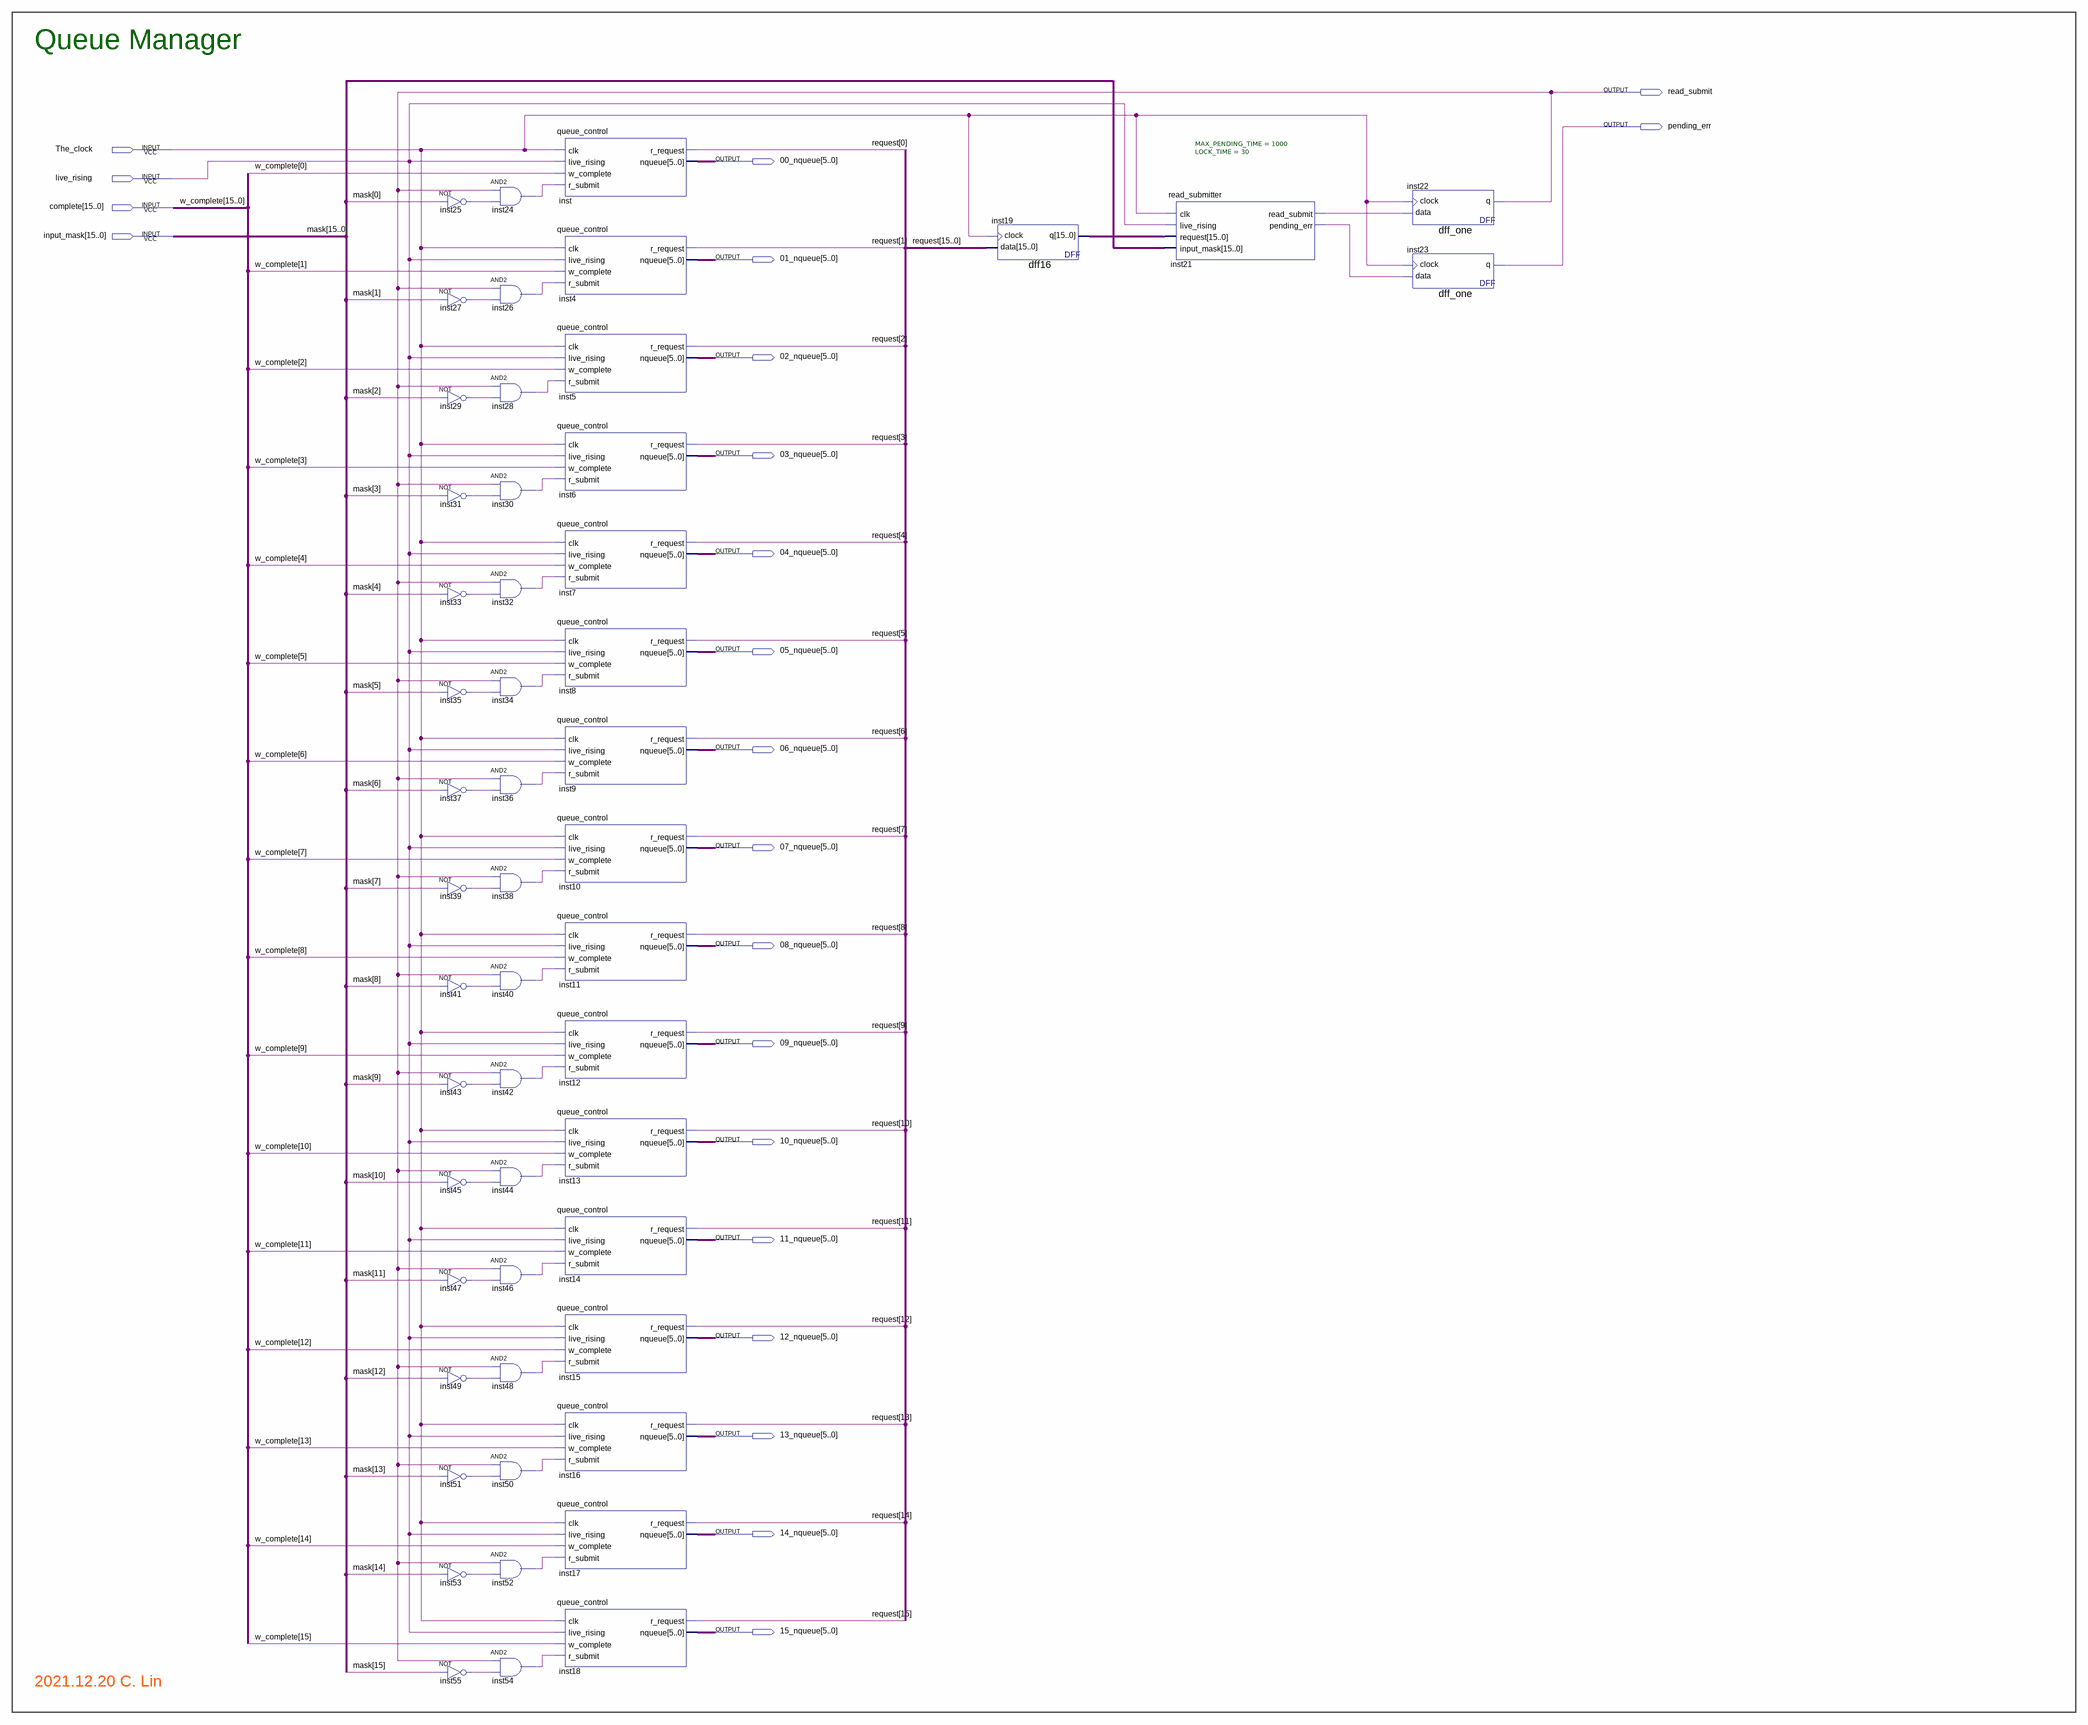
[diagram p0: schematic sheet]
// Quartus schematic queue_manager.bdf as structural Verilog: 52 symbols, 22 pins
module queue_manager (
  input  The_clock,
  input  live_rising,
  input  [15:0] complete,
  input  [15:0] input_mask,
  output read_submit,
  output pending_err,
  output [5:0] \00_nqueue ,
  output [5:0] \01_nqueue ,
  output [5:0] \02_nqueue ,
  output [5:0] \03_nqueue ,
  output [5:0] \04_nqueue ,
  output [5:0] \05_nqueue ,
  output [5:0] \06_nqueue ,
  output [5:0] \07_nqueue ,
  output [5:0] \08_nqueue ,
  output [5:0] \09_nqueue ,
  output [5:0] \10_nqueue ,
  output [5:0] \11_nqueue ,
  output [5:0] \12_nqueue ,
  output [5:0] \13_nqueue ,
  output [5:0] \14_nqueue ,
  output [5:0] \15_nqueue 
);

  wire inst21_pending_err, inst21_read_submit, inst24_out, inst25_out, inst26_out, inst27_out, inst28_out,
       inst29_out, inst30_out, inst31_out, inst32_out, inst33_out, inst34_out, inst35_out, inst36_out,
       inst37_out, inst38_out, inst39_out, inst40_out, inst41_out, inst42_out, inst43_out, inst44_out,
       inst45_out, inst46_out, inst47_out, inst48_out, inst49_out, inst50_out, inst51_out, inst52_out,
       inst53_out, inst54_out, inst55_out;
  wire [15:0] inst19_q, request;

  not inst25 (inst25_out, input_mask[0]);
  not inst27 (inst27_out, input_mask[1]);
  not inst29 (inst29_out, input_mask[2]);
  not inst31 (inst31_out, input_mask[3]);
  not inst33 (inst33_out, input_mask[4]);
  not inst35 (inst35_out, input_mask[5]);
  not inst37 (inst37_out, input_mask[6]);
  not inst39 (inst39_out, input_mask[7]);
  not inst41 (inst41_out, input_mask[8]);
  not inst43 (inst43_out, input_mask[9]);
  not inst45 (inst45_out, input_mask[10]);
  not inst47 (inst47_out, input_mask[11]);
  not inst49 (inst49_out, input_mask[12]);
  not inst51 (inst51_out, input_mask[13]);
  not inst53 (inst53_out, input_mask[14]);
  not inst55 (inst55_out, input_mask[15]);
  and inst24 (inst24_out, read_submit, inst25_out);
  and inst26 (inst26_out, read_submit, inst27_out);
  and inst28 (inst28_out, read_submit, inst29_out);
  and inst30 (inst30_out, read_submit, inst31_out);
  and inst32 (inst32_out, read_submit, inst33_out);
  and inst34 (inst34_out, read_submit, inst35_out);
  and inst36 (inst36_out, read_submit, inst37_out);
  and inst38 (inst38_out, read_submit, inst39_out);
  and inst40 (inst40_out, read_submit, inst41_out);
  and inst42 (inst42_out, read_submit, inst43_out);
  and inst44 (inst44_out, read_submit, inst45_out);
  and inst46 (inst46_out, read_submit, inst47_out);
  and inst48 (inst48_out, read_submit, inst49_out);
  and inst50 (inst50_out, read_submit, inst51_out);
  and inst52 (inst52_out, read_submit, inst53_out);
  and inst54 (inst54_out, read_submit, inst55_out);
  queue_control inst (
    .clk(The_clock), .live_rising(live_rising), .w_complete(complete[0]), .r_submit(inst24_out),
    .r_request(request[0]), .nqueue(\00_nqueue ));
  queue_control inst4 (
    .clk(The_clock), .live_rising(live_rising), .w_complete(complete[1]), .r_submit(inst26_out),
    .r_request(request[1]), .nqueue(\01_nqueue ));
  queue_control inst5 (
    .clk(The_clock), .live_rising(live_rising), .w_complete(complete[2]), .r_submit(inst28_out),
    .r_request(request[2]), .nqueue(\02_nqueue ));
  queue_control inst6 (
    .clk(The_clock), .live_rising(live_rising), .w_complete(complete[3]), .r_submit(inst30_out),
    .r_request(request[3]), .nqueue(\03_nqueue ));
  queue_control inst7 (
    .clk(The_clock), .live_rising(live_rising), .w_complete(complete[4]), .r_submit(inst32_out),
    .r_request(request[4]), .nqueue(\04_nqueue ));
  queue_control inst8 (
    .clk(The_clock), .live_rising(live_rising), .w_complete(complete[5]), .r_submit(inst34_out),
    .r_request(request[5]), .nqueue(\05_nqueue ));
  queue_control inst9 (
    .clk(The_clock), .live_rising(live_rising), .w_complete(complete[6]), .r_submit(inst36_out),
    .r_request(request[6]), .nqueue(\06_nqueue ));
  queue_control inst10 (
    .clk(The_clock), .live_rising(live_rising), .w_complete(complete[7]), .r_submit(inst38_out),
    .r_request(request[7]), .nqueue(\07_nqueue ));
  queue_control inst11 (
    .clk(The_clock), .live_rising(live_rising), .w_complete(complete[8]), .r_submit(inst40_out),
    .r_request(request[8]), .nqueue(\08_nqueue ));
  queue_control inst12 (
    .clk(The_clock), .live_rising(live_rising), .w_complete(complete[9]), .r_submit(inst42_out),
    .r_request(request[9]), .nqueue(\09_nqueue ));
  queue_control inst13 (
    .clk(The_clock), .live_rising(live_rising), .w_complete(complete[10]), .r_submit(inst44_out),
    .r_request(request[10]), .nqueue(\10_nqueue ));
  queue_control inst14 (
    .clk(The_clock), .live_rising(live_rising), .w_complete(complete[11]), .r_submit(inst46_out),
    .r_request(request[11]), .nqueue(\11_nqueue ));
  queue_control inst15 (
    .clk(The_clock), .live_rising(live_rising), .w_complete(complete[12]), .r_submit(inst48_out),
    .r_request(request[12]), .nqueue(\12_nqueue ));
  queue_control inst16 (
    .clk(The_clock), .live_rising(live_rising), .w_complete(complete[13]), .r_submit(inst50_out),
    .r_request(request[13]), .nqueue(\13_nqueue ));
  queue_control inst17 (
    .clk(The_clock), .live_rising(live_rising), .w_complete(complete[14]), .r_submit(inst52_out),
    .r_request(request[14]), .nqueue(\14_nqueue ));
  queue_control inst18 (
    .clk(The_clock), .live_rising(live_rising), .w_complete(complete[15]), .r_submit(inst54_out),
    .r_request(request[15]), .nqueue(\15_nqueue ));
  dff16 inst19 (.data(request), .clock(The_clock), .q(inst19_q));
  read_submitter #(.MAX_PENDING_TIME(1000), .LOCK_TIME(30)) inst21 (
    .clk(The_clock), .live_rising(live_rising), .request(inst19_q), .input_mask(input_mask),
    .read_submit(inst21_read_submit), .pending_err(inst21_pending_err));
  dff_one inst22 (.data(inst21_read_submit), .clock(The_clock), .q(read_submit));
  dff_one inst23 (.data(inst21_pending_err), .clock(The_clock), .q(pending_err));

  // Other names for the same wires on the sheet: mask[15:0] = input_mask; w_complete[15:0] = complete

  // Notes on the sheet:
  //   Queue Manager
  //   2021.12.20 C. Lin
endmodule
